# EAGLE schematic Placa_sensores_sch (EAGLE 9.7.0)
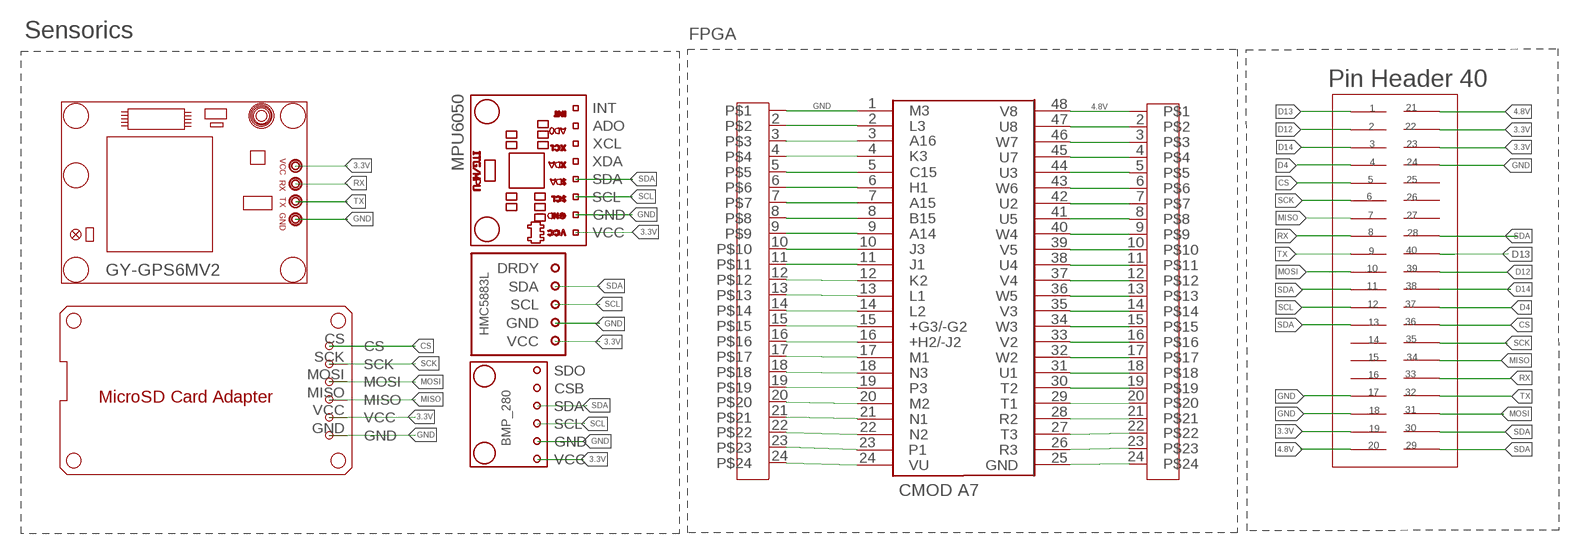
[diagram p0: schematic, sheet 1]

## Parts
CMOD  CMOD-A7  [CMOD-A7]
U1  GY-521  [GY-521]
U2  HMC5883L  [GY-271]
U$1  GY-BPM280  [GY-BMP280-FOOTPRINT]
U$2  GPS-NEO-6M  [GPS-NEO-6M]
U$3  PINHEADER  [PINHEADER]
U$4  SD_MODULE  [SD_MODULE]
U$5  PIN1X24  [PIN_1X24]
U$6  PIN1X24  [PIN_1X24]

## Nets
3.3V: U1.VCC U2.VCC U$1.VCC U$2.P$1 U$3.19 U$3.22 U$3.23 U$4.VCC
4.8V: CMOD.48(V8) U$3.20 U$3.21 U$5.1
CS: U$3.5 U$3.36 U$4.CS
D4: U$3.4 U$3.37
D12: U$3.2 U$3.39
D13: U$3.1 U$3.40
D14: U$3.3 U$3.38
GND: CMOD.1(M3) U1.GND U2.GND U$1.GND U$2.P$4 U$3.17 U$3.18 U$3.24 U$4.GND U$6.1
MISO: U$3.7 U$3.34 U$4.MISO
MOSI: U$3.10 U$3.31 U$4.MOSI
N$3: CMOD.47(U8) U$5.2
N$4: CMOD.46(W7) U$5.3
N$5: CMOD.45(U7) U$5.4
N$6: CMOD.44(U3) U$5.5
N$7: CMOD.43(W6) U$5.6
N$8: CMOD.42(U2) U$5.7
N$9: CMOD.41(U5) U$5.8
N$10: CMOD.27(T3) U$5.22
N$11: CMOD.40(W4) U$5.9
N$12: CMOD.39(V5) U$5.10
N$13: CMOD.26(R3) U$5.23
N$14: CMOD.38(U4) U$5.11
N$15: CMOD.37(V4) U$5.12
N$16: CMOD.36(W5) U$5.13
N$17: CMOD.35(V3) U$5.14
N$18: CMOD.34(W3) U$5.15
N$19: CMOD.33(V2) U$5.16
N$20: CMOD.32(W2) U$5.17
N$21: CMOD.31(U1) U$5.18
N$22: CMOD.30(T2) U$5.19
N$23: CMOD.29(T1) U$5.20
N$24: CMOD.28(R2) U$5.21
N$25: CMOD.25(GND) U$5.24
N$27: CMOD.2(L3) U$6.2
N$28: CMOD.3(A16) U$6.3
N$29: CMOD.4(K3) U$6.4
N$30: CMOD.5(C15) U$6.5
N$31: CMOD.6(H1) U$6.6
N$32: CMOD.7(A15) U$6.7
N$33: CMOD.24(VU) U$6.24
N$34: CMOD.23(P1) U$6.23
N$35: CMOD.22(N2) U$6.22
N$36: CMOD.21(N1) U$6.21
N$37: CMOD.20(M2) U$6.20
N$38: CMOD.19(P3) U$6.19
N$39: CMOD.18(N3) U$6.18
N$40: CMOD.17(M1) U$6.17
N$41: CMOD.16(+H2/-J2) U$6.16
N$42: CMOD.15(+G3/-G2) U$6.15
N$43: CMOD.14(L2) U$6.14
N$44: CMOD.13(L1) U$6.13
N$45: CMOD.12(K2) U$6.12
N$46: CMOD.11(J1) U$6.11
N$47: CMOD.10(J3) U$6.10
N$48: CMOD.9(A14) U$6.9
N$49: CMOD.8(B15) U$6.8
RX: U$2.P$2 U$3.8 U$3.33
SCK: U$3.6 U$3.35 U$4.SCK
SCL: U1.SCL U2.SCL U$1.SCK(SCL) U$3.12
SDA: U1.SDA U2.SDA U$1.SDI(SDA) U$3.11 U$3.13 U$3.28 U$3.29 U$3.30
TX: U$2.P$3 U$3.9 U$3.32
Unconnected: U1.ADO U1.INT U1.XCL U1.XDA U2.DRDY U$1.CSB U$1.SDO U$3.14 U$3.15 U$3.16 U$3.25 U$3.26 U$3.27

## Notes on the sheet
- Sensorics | FPGA
- Pin Header 40
- 1 | 21
- 2 | 22
- 3 | 23
- 4 | 24
- 5 | 25
- 6 | 26
- 7 | 27
- 8 | 28
- 9 | 40
- 10 | 39
- 11 | 38
- 12 | 37
- 13 | 36
- 14 | 35
- 15 | 34
- 16 | 33
- 17 | 32
- 18 | 31
- 19 | 30
- 20 | 29

## Library data of the parts
CMOD = CMOD-A7:CMOD-A7
U1 = MPU6050:GY-521: Check availability <https://pricing.snapeda.com/parts/GY-521/GODREAM%20FORDREAM%20CO.%2C%20LIMITED/view-part?ref=eda>
U2 = HMC5883L:HMC5883L
U$1 = BMP_280:GY-BPM280
U$2 = GPS-NEO-6M:GPS-NEO-6M
U$3 = PINHEADER-40:PINHEADER
U$4 = SD_MODULE:SD_MODULE
U$5 U$6 = PIN_1X24:PIN1X24

## Module WF
Ports: 

### Library data of the parts